# Altium schematic sheet LCL_SYM_5V.SchDoc
size A3; Organization: Altium Limited; Address1: L3, 12a Rodborough Rd; Address2: Frenchs Forest; Address3: NSW; Address4: Australia 2086
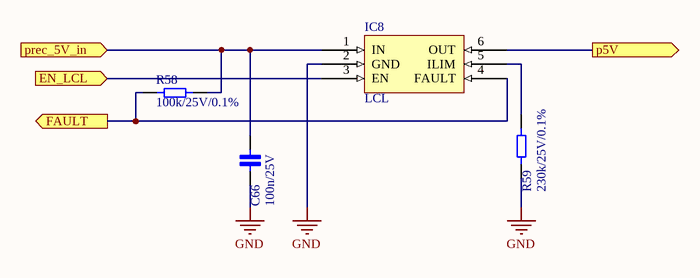
[diagram p0: LCL_SYM_5V.SchDoc]

## Parts
C66  100n/25V  [CAP_0603]
IC8  LCL  [SOT-23-6]
R58  100k/25V/0.1%  [RES_0603]
R59  230k/25V/0.1%  [RES_0603]

## Ports
EN_LCL (in), FAULT (out), p5V (out), prec_5V_in (in)

## Nets
GND: C66.1 IC8.2(GND) R59.2
EN_LCL: IC8.3(EN) ; port EN_LCL
FAULT: IC8.4(FAULT) R58.1 ; port FAULT
p5V: IC8.6(OUT) ; port p5V
prec_5V_in: C66.2 IC8.1(IN) R58.2 ; port prec_5V_in
NetIC8_5: IC8.5(ILIM) R59.2

## Notes on the sheet
- Title
- Size:
- Date:
- A3
- Number:
- Time:
- Revision:
- Sheet
- of
- File:

## Library data of the parts
C66 = Cap_0603_100n: Ceramic Capacitor 100n / 0603 / 25V / ±5%, Wurth Elektronik MLCC; ComponentLink1Description: New link; ComponentLink1URL: https://www.we-online.com/catalog/en/WCAP-CSGP-25VDC
IC8 = TPS2553: Latch-off Current Limiter; ComponentLink1Description: New link; ComponentLink1URL: https://www.ti.com/lit/ds/symlink/tps2553.pdf?ts=1603819295065&ref_url=https%253A%252F%252Fwww.google.com%252F
R58 = Res_0603_100k: Vishay, thin film resistor 100k/25V/0.1%
R59 = Res_0603_230k: Vishay, thin film resistor 230k/25V/0.1%